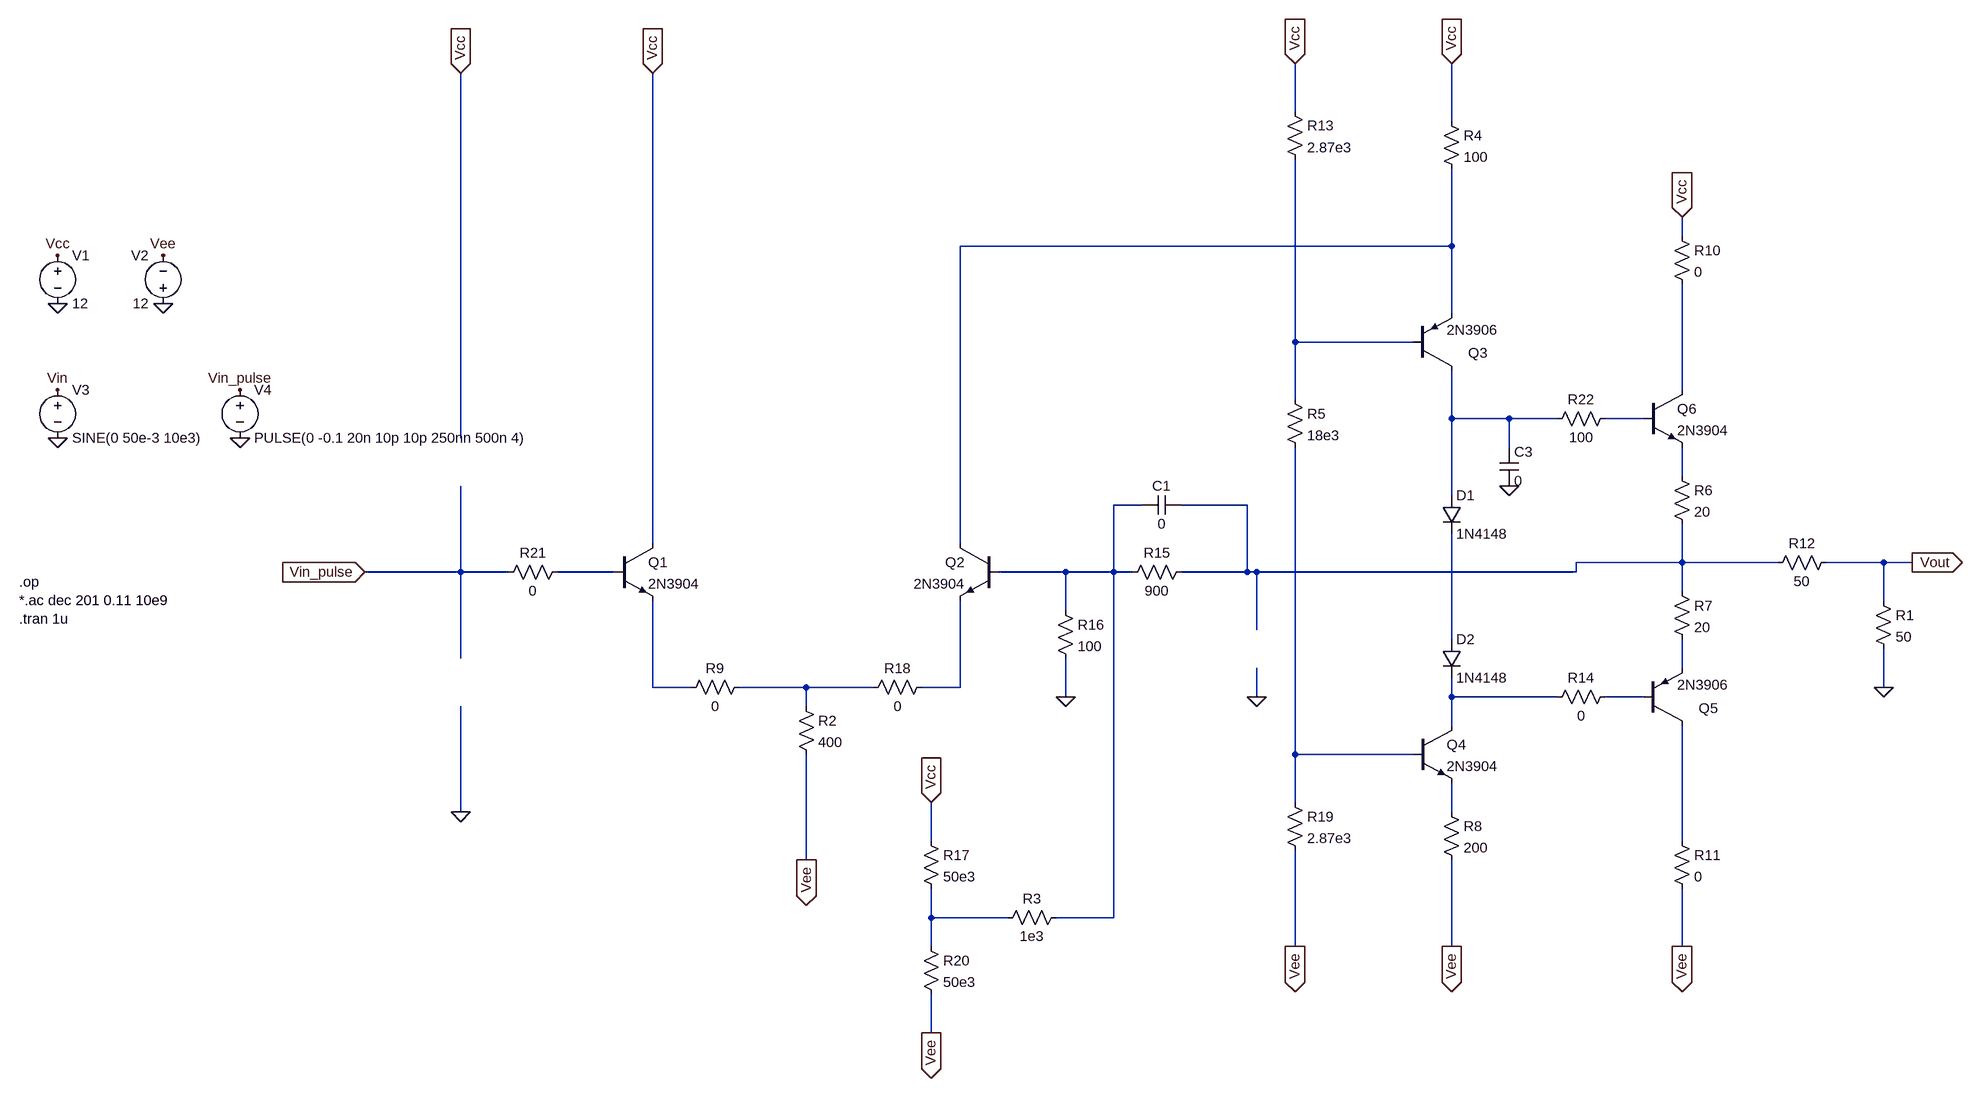
[diagram p0: schematic output_amplifier_folded_cascode.asc]
output_amplifier_folded_cascode.asc, the LTspice schematic file:
Version 4
SHEET 1 2212 1224
WIRE 928 -400 928 -480
WIRE 1344 -384 1344 -480
WIRE 1728 -192 1728 -224
WIRE 1344 -176 1344 -304
WIRE 1344 -176 368 -176
WIRE 1344 -64 1344 -176
WIRE 928 -16 928 -320
WIRE 1280 -16 928 -16
WIRE 1728 64 1728 -112
WIRE 928 80 928 -16
WIRE 1344 112 1344 32
WIRE 1440 112 1344 112
WIRE 1520 112 1440 112
WIRE 1664 112 1600 112
WIRE -464 144 -464 -464
WIRE 1440 160 1440 112
WIRE 1728 208 1728 160
WIRE 1344 240 1344 112
WIRE 672 256 624 256
WIRE 848 256 736 256
WIRE -144 320 -144 -464
WIRE 368 320 368 -176
WIRE 1728 352 1728 288
WIRE 1728 352 1552 352
WIRE 1888 352 1728 352
WIRE 2064 352 1968 352
WIRE 2112 352 2064 352
WIRE -464 368 -464 224
WIRE -464 368 -624 368
WIRE -384 368 -464 368
WIRE -208 368 -304 368
WIRE 544 368 432 368
WIRE 624 368 624 256
WIRE 624 368 544 368
WIRE 656 368 624 368
WIRE 848 368 848 256
WIRE 848 368 736 368
WIRE 864 368 848 368
WIRE 1552 368 1552 352
WIRE 1552 368 864 368
WIRE 1728 400 1728 352
WIRE 2064 416 2064 352
WIRE 544 432 544 368
WIRE 864 464 864 368
WIRE 1344 480 1344 304
WIRE -464 512 -464 368
WIRE 1728 528 1728 480
WIRE -144 560 -144 416
WIRE -80 560 -144 560
WIRE 112 560 0 560
WIRE 224 560 112 560
WIRE 368 560 368 416
WIRE 368 560 304 560
WIRE 2064 560 2064 496
WIRE 544 576 544 512
WIRE 864 576 864 528
WIRE 1344 576 1344 544
WIRE 1520 576 1344 576
WIRE 1664 576 1600 576
WIRE 112 592 112 560
WIRE 1344 624 1344 576
WIRE 928 672 928 160
WIRE 1280 672 928 672
WIRE 928 752 928 672
WIRE -464 768 -464 592
WIRE 1344 768 1344 720
WIRE 320 816 320 752
WIRE 1728 816 1728 624
WIRE 112 848 112 672
WIRE 320 944 320 896
WIRE 448 944 320 944
WIRE 624 944 624 368
WIRE 624 944 528 944
WIRE 320 992 320 944
WIRE 928 992 928 832
WIRE 1344 992 1344 848
WIRE 1728 992 1728 896
WIRE 320 1136 320 1072
FLAG -960 -80 0
FLAG -1136 -80 0
FLAG -1136 -160 Vcc
FLAG -960 -160 Vee
FLAG -624 368 Vin_pulse
IOPIN -624 368 In
FLAG -1136 144 0
FLAG -1136 64 Vin
FLAG -464 768 0
FLAG 112 848 Vee
IOPIN 112 848 Out
FLAG -144 -464 Vcc
IOPIN -144 -464 In
FLAG 1344 -480 Vcc
IOPIN 1344 -480 In
FLAG 1728 -224 Vcc
IOPIN 1728 -224 In
FLAG 1344 992 Vee
IOPIN 1344 992 Out
FLAG 1728 992 Vee
IOPIN 1728 992 Out
FLAG 928 -480 Vcc
IOPIN 928 -480 In
FLAG 2112 352 Vout
IOPIN 2112 352 Out
FLAG -464 -464 Vcc
IOPIN -464 -464 In
FLAG 928 992 Vee
IOPIN 928 992 Out
FLAG 544 576 0
FLAG 320 1136 Vee
IOPIN 320 1136 Out
FLAG 320 752 Vcc
IOPIN 320 752 In
FLAG -832 144 0
FLAG -832 64 Vin_pulse
FLAG 864 576 0
FLAG 1440 224 0
FLAG 2064 560 0
DATAFLAG 1200 -16 "$"
DATAFLAG 1152 672 "$"
DATAFLAG 1344 -112 "$"
DATAFLAG 1344 752 "$"
DATAFLAG 2016 352 "$"
DATAFLAG 464 368 "$"
DATAFLAG 368 944 "$"
DATAFLAG 624 848 "$"
DATAFLAG -544 368 "$"
DATAFLAG -272 368 "$"
DATAFLAG 1344 64 "$"
DATAFLAG 672 -176 "$"
DATAFLAG 1456 576 "$"
DATAFLAG 1344 352 "$"
DATAFLAG 1728 176 "$"
DATAFLAG 1104 368 "$"
SYMBOL npn -208 320 R0
SYMATTR InstName Q1
SYMATTR Value 2N3904
SYMBOL npn 432 320 M0
SYMATTR InstName Q2
SYMATTR Value 2N3904
SYMBOL Res 96 576 R0
SYMATTR InstName R2
SYMATTR Value 400
SYMBOL voltage -1136 -176 R0
SYMATTR InstName V1
SYMATTR Value 12
SYMBOL voltage -960 -64 R180
WINDOW 0 24 96 Left 2
WINDOW 3 24 16 Left 2
SYMATTR InstName V2
SYMATTR Value 12
SYMBOL voltage -1136 48 R0
SYMATTR InstName V3
SYMATTR Value SINE(0 50e-3 10e3)
SYMATTR Value2 AC 0.5
SYMBOL res 1328 -400 R0
SYMATTR InstName R4
SYMATTR Value 100
SYMBOL res 912 64 R0
SYMATTR InstName R5
SYMATTR Value 18e3
SYMBOL pnp 1280 32 M180
WINDOW 0 92 29 Left 2
SYMATTR InstName Q3
SYMATTR Value 2N3906
SYMBOL diode 1328 240 R0
SYMATTR InstName D1
SYMATTR Value 1N4148
SYMBOL diode 1328 480 R0
SYMATTR InstName D2
SYMATTR Value 1N4148
SYMBOL npn 1280 624 R0
SYMATTR InstName Q4
SYMATTR Value 2N3904
SYMBOL res 1712 192 R0
SYMATTR InstName R6
SYMATTR Value 20
SYMBOL res 1712 384 R0
SYMATTR InstName R7
SYMATTR Value 20
SYMBOL res 1328 752 R0
SYMATTR InstName R8
SYMATTR Value 200
SYMBOL res 1712 -208 R0
SYMATTR InstName R10
SYMATTR Value 0
SYMBOL res 1712 800 R0
SYMATTR InstName R11
SYMATTR Value 0
SYMBOL res 1984 336 R90
WINDOW 0 0 56 VBottom 2
WINDOW 3 32 56 VTop 2
SYMATTR InstName R12
SYMATTR Value 50
SYMBOL res 912 -416 R0
SYMATTR InstName R13
SYMATTR Value 2.87e3
SYMBOL res 640 384 R270
WINDOW 0 32 56 VTop 2
WINDOW 3 0 56 VBottom 2
SYMATTR InstName R15
SYMATTR Value 900
SYMBOL res 528 416 R0
SYMATTR InstName R16
SYMATTR Value 100
SYMBOL res 912 736 R0
SYMATTR InstName R19
SYMATTR Value 2.87e3
SYMBOL res 304 800 R0
SYMATTR InstName R17
SYMATTR Value 50e3
SYMBOL res 304 976 R0
SYMATTR InstName R20
SYMATTR Value 50e3
SYMBOL Res 544 928 R90
WINDOW 0 0 56 VBottom 2
WINDOW 3 32 56 VTop 2
SYMATTR InstName R3
SYMATTR Value 1e3
SYMBOL Res 16 544 R90
WINDOW 0 0 56 VBottom 2
WINDOW 3 32 56 VTop 2
SYMATTR InstName R9
SYMATTR Value 0
SYMBOL Res 320 544 R90
WINDOW 0 0 56 VBottom 2
WINDOW 3 32 56 VTop 2
SYMATTR InstName R18
SYMATTR Value 0
SYMBOL Cap 736 240 R90
WINDOW 0 0 32 VBottom 2
WINDOW 3 32 32 VTop 2
SYMATTR InstName C1
SYMATTR Value 0
SYMBOL Res -400 384 R270
WINDOW 0 32 56 VTop 2
WINDOW 3 0 56 VBottom 2
SYMATTR InstName R21
SYMATTR Value 0
SYMBOL voltage -832 48 R0
SYMATTR InstName V4
SYMATTR Value PULSE(0 -0.1 20n 10p 10p 250nn 500n 4)
SYMATTR Value2 AC 1
SYMBOL Cap 1424 160 R0
SYMATTR InstName C3
SYMATTR Value 0
SYMBOL Res 2048 400 R0
SYMATTR InstName R1
SYMATTR Value 50
SYMBOL Res 1616 560 R90
WINDOW 0 0 56 VBottom 2
WINDOW 3 32 56 VTop 2
SYMATTR InstName R14
SYMATTR Value 0
SYMBOL Res 1616 96 R90
WINDOW 0 0 56 VBottom 2
WINDOW 3 32 56 VTop 2
SYMATTR InstName R22
SYMATTR Value 100
SYMBOL pnp 1664 624 M180
WINDOW 0 92 29 Left 2
SYMATTR InstName Q5
SYMATTR Value 2N3906
SYMBOL npn 1664 64 R0
SYMATTR InstName Q6
SYMATTR Value 2N3904
TEXT -1200 384 Left 2 !.op\n*.ac dec 201 0.11 10e9\n.tran 1u

The netlist it stands for:
* output_amplifier_folded_cascode.asc
Q1 Vcc N009 N012 0 2N3904
Q2 N001 N007 N014 0 2N3904
R2 N013 Vee 400
V1 Vcc 0 12
V2 0 Vee 12
V3 Vin 0 SINE(0 50e-3 10e3) AC 0.5
R4 Vcc N001 100
R5 N002 N017 18e3
Q3 N004 N002 N001 0 2N3906
D1 N004 N010 1N4148
D2 N010 N015 1N4148
Q4 N015 N017 N018 0 2N3904
R6 N006 N008 20
R7 N008 N011 20
R8 N018 Vee 200
R10 Vcc N003 0
R11 N019 Vee 0
R12 Vout N008 50
R13 Vcc N002 2.87e3
R15 N007 N008 900
R16 N007 0 100
R19 N017 Vee 2.87e3
R17 Vcc N020 50e3
R20 N020 Vee 50e3
R3 N007 N020 1e3
R9 N013 N012 0
R18 N014 N013 0
C1 N008 N007 0
R21 Vin_pulse N009 0
V4 Vin_pulse 0 PULSE(0 -0.1 20n 10p 10p 250nn 500n 4) AC 1
C3 N004 0 0
R1 Vout 0 50
R14 N016 N015 0
R22 N005 N004 100
Q5 N019 N016 N011 0 2N3906
Q6 N003 N005 N006 0 2N3904
.model D D
.lib standard.dio
.model NPN NPN
.model PNP PNP
.lib standard.bjt
.op
*.ac dec 201 0.11 10e9
.tran 1u
.backanno
.end